# Altium schematic sheet HLK-AX3000-KIT-POWER_LED.SchDoc
size A3
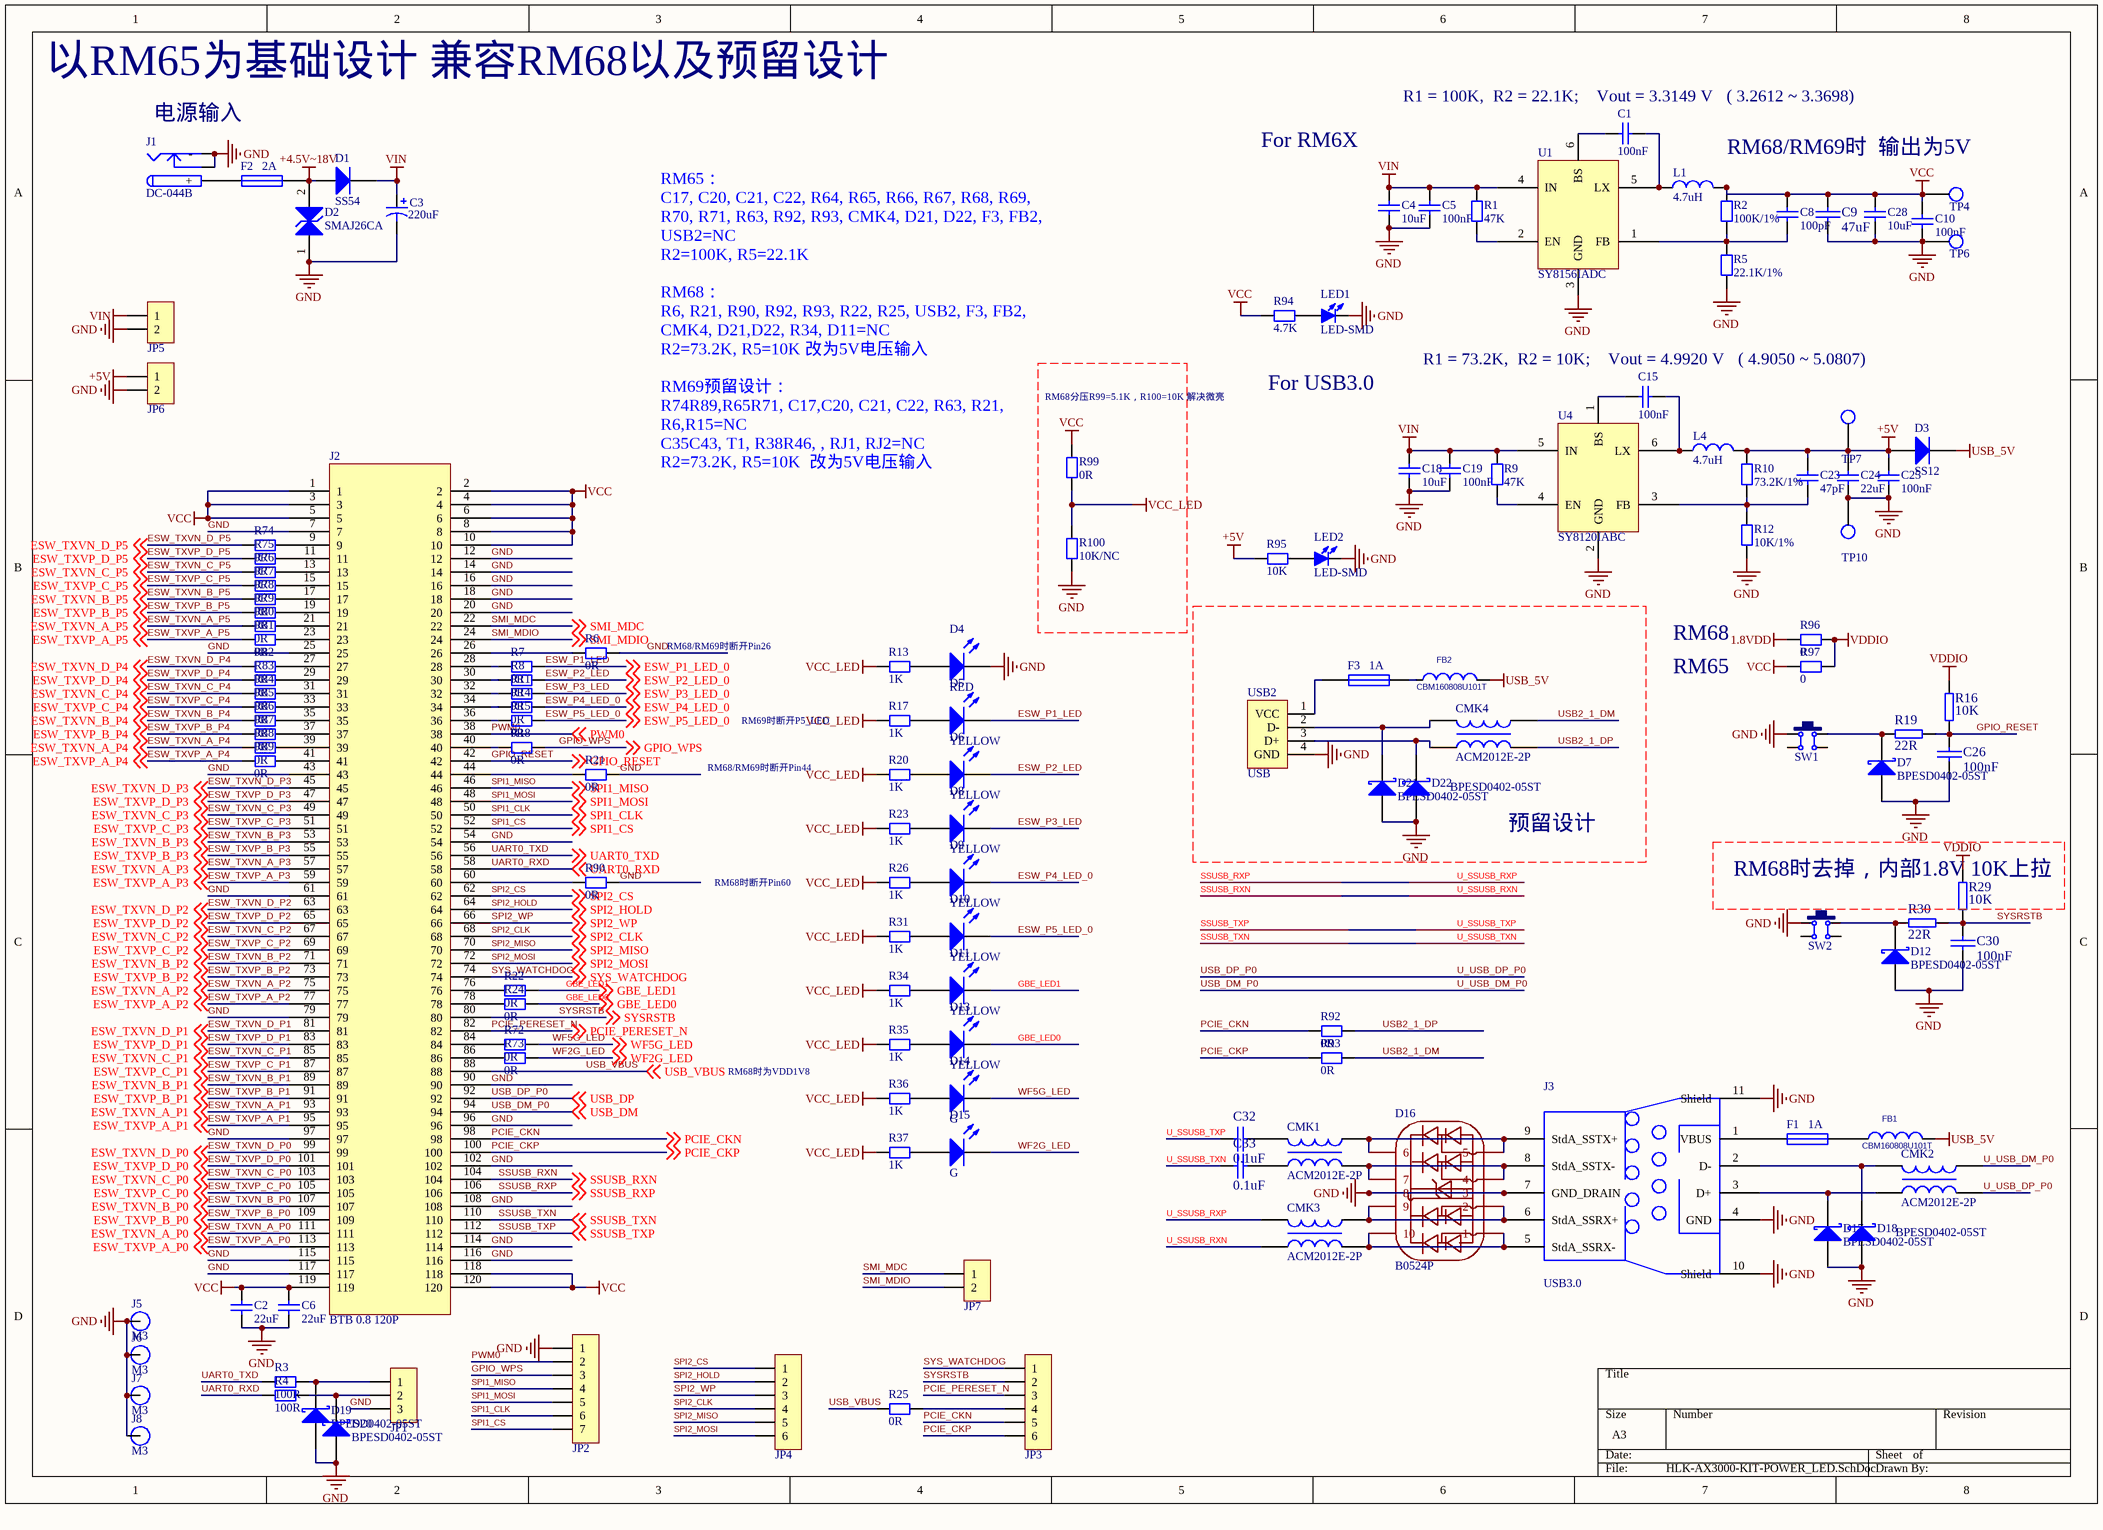
[diagram p0: HLK-AX3000-KIT-POWER_LED.SchDoc]

## Parts
C1  100nF  [C 0402_L]
C2  22uF  [C 0805_L]
C3  220uF  [CT 8*12 - C]
C4  10uF  [C 0805_L]
C5  100nF  [C 0402_L]
C6  22uF  [C 0805_L]
C8  100pF  [C 0402_L]
C9  47uF  [C 1206_L]
C10  100nF  [C 0402_L]
C15  100nF  [C 0402_L]
C18  10uF  [C 0805_L]
C19  100nF  [C 0402_L]
C23  47pF  [C 0402_L]
C24  22uF  [C 0805_L]
C25  100nF  [C 0402_L]
C26  100nF  [C 0402_L]
C28  10uF  [C 0603_L]
C30  100nF  [C 0402_L]
C32  0.1uF  [C 0402_L]
C33  0.1uF  [C 0402_L]
CMK1  ACM2012E-2P  [SMD_4P]
CMK2  ACM2012E-2P  [SMD_4P]
CMK3  ACM2012E-2P  [SMD_4P]
CMK4  ACM2012E-2P  [SMD_4P_2.1X2.1]
D1  SS54  [SMB]
D2  SMAJ26CA  [DO-214AC]
D3  SS12  [SMA]
D4  RED  [LED 3MM-R]
D5  YELLOW  [LED 3MM-Y]
D6  YELLOW  [LED 3MM-Y]
D7  BPESD0402-05ST  [esd0402]
D8  YELLOW  [LED 3MM-Y]
D9  YELLOW  [LED 3MM-Y]
D10  YELLOW  [LED 3MM-Y]
D11  YELLOW  [LED 3MM-Y]
D12  BPESD0402-05ST  [esd0402]
D13  YELLOW  [LED 3MM-Y]
D14  G  [LED 3MM-G]
D15  G  [LED 3MM-G]
D16  B0524P  [DFN-10]
D17  BPESD0402-05ST  [ESD0402]
D18  BPESD0402-05ST  [ESD0402]
D19  BPESD0402-05ST  [esd0402]
D20  BPESD0402-05ST  [esd0402]
D21  BPESD0402-05ST  [ESD0402]
D22  BPESD0402-05ST  [ESD0402]
F1  1A  [FU 0603]
F2  2A  [FU 1206]
F3  1A  [FU 0603]
FB1  CBM160808U101T  [L 0603]
FB2  CBM160808U101T  [L 0603]
J1  DC-044B  [DC-005]
J2  BTB 0.8 120P  [HLK-RM65]
J3  USB3.0  [USB3.0-9P-DIP]
J5  M3  [M3 125X200]
J6  M3  [M3 125X200]
J7  M3  [M3 125X200]
J8  M3  [M3 125X200]
JP1  HDR-1X3  [HDR2.54-LI-3P]  (value not drawn)
JP2  HDR-1X7  [HDR2.54-LI-7P]  (value not drawn)
JP3  HDR-1X6  [HDR2.54-LI-6P]  (value not drawn)
JP4  HDR-1X6  [HDR2.54-LI-6P]  (value not drawn)
JP5  HDR-1X2  [XH2.54-LI-2P]  (value not drawn)
JP6  HDR-1X2  [XH2.54-LI-2P]  (value not drawn)
JP7  HDR-1X2  [HDR2.54-LI-2P]  (value not drawn)
L1  4.7uH  [L 6*6]
L4  4.7uH  [L 4*4]
LED1  LED-SMD  [LED 0603G-L]
LED2  LED-SMD  [LED 0603G-L]
R1  47K  [R 0402_L]
R2  100K/1%  [R 0402_L]
R3  100R  [R 0402_L]
R4  100R  [R 0402_L]
R5  22.1K/1%  [R 0402_L]
R6  0R  [R 0402_L]
R7  0R  [R 0402_L]
R8  0R  [R 0402_L]
R9  47K  [R 0402_L]
R10  73.2K/1%  [R 0402_L]
R11  0R  [R 0402_L]
R12  10K/1%  [R 0402_L]
R13  1K  [R 0402_L]
R14  0R  [R 0402_L]
R15  0R  [R 0402_L]
R16  10K  [R 0402_l]
R17  1K  [R 0402_L]
R18  0R  [R 0402_L]
R19  22R  [R 0402_l]
R20  1K  [R 0402_L]
R21  0R  [R 0402_L]
R22  0R  [R 0402_L]
R23  1K  [R 0402_L]
R24  0R  [R 0402_L]
R25  0R  [R 0402_L]
R26  1K  [R 0402_L]
R29  10K  [R 0402_l]
R30  22R  [R 0402_l]
R31  1K  [R 0402_L]
R34  1K  [R 0402_L]
R35  1K  [R 0402_L]
R36  1K  [R 0402_L]
R37  1K  [R 0402_L]
R72  0R  [R 0402_L]
R73  0R  [R 0402_L]
R74  0R  [R 0402_L]
R75  0R  [R 0402_L]
R76  0R  [R 0402_L]
R77  0R  [R 0402_L]
R78  0R  [R 0402_L]
R79  0R  [R 0402_L]
R80  0R  [R 0402_L]
R81  0R  [R 0402_L]
R82  0R  [R 0402_L]
R83  0R  [R 0402_L]
R84  0R  [R 0402_L]
R85  0R  [R 0402_L]
R86  0R  [R 0402_L]
R87  0R  [R 0402_L]
R88  0R  [R 0402_L]
R89  0R  [R 0402_L]
R90  0R  [R 0402_L]
R92  0R  [R 0402_L]
R93  0R  [R 0402_L]
R94  4.7K  [R 0402_L]
R95  10K  [R 0402_L]
R96  0  [R 0402_L]
R97  0  [R 0402_L]
R99  0R  [R 0402_L]
R100  10K/NC  [R 0402_L]
SW1  6x6x5  [TSW DIP-4.5*4.5*3_V]  (value not drawn)
SW2  6x6x5  [TSW DIP-4.5*4.5*3_V]  (value not drawn)
TP4  测试点  [TEST 1.6]  (value not drawn)
TP6  测试点  [TEST 1.6]  (value not drawn)
TP7  测试点  [TEST 1.6]  (value not drawn)
TP10  测试点  [TEST 1.6]  (value not drawn)
U1  SY8156IADC  [SOT23-6N]
U4  SY8120IABC  [SOT23-6N]
USB2  USB  [USB-A/S_E]

## Nets
1.8VDD: R96.2
+4.5V~18V: D1.1(A) D2.2 F2.2
+5V: C23.2 C24.2 C25.1 D3.1(A) JP6.1 L4.2 R10.1 R95.2 TP7.1
GND: C2.1 C3.2 C4.1 C5.2 C6.1 C9.1 C10.2 C18.1 C19.2 C24.1 C25.2 C26.1 C28.2 C30.1 D2.1 D4.2(K) D7.1(A) D12.1(A) D16.3 D16.8 D17.1(A) D18.1(A) D19.1(A) D20.1(A) D21.1(A) D22.1(A) J1.2(-) J1.3 J2.7 J2.12 J2.14 J2.16 J2.18 J2.20 J2.25 J2.43 J2.54 J2.61 J2.79 J2.90 J2.96 J2.97 J2.102 J2.108 J2.114 J2.115 J2.116 J2.117 J3.4(GND) J3.7(GND_DRAIN) J3.10(Shield) J3.11(Shield) J5.1(GND) J6.1(GND) J7.1(GND) J8.1(GND) JP1.3 JP2.1 JP5.2 JP6.2 LED1.2(K) LED2.2(K) R5.2 R6.1 R12.2 R21.1 R90.1 R100.2 SW1.1 SW2.1 TP6.1 TP10.1 U1.3(GND) U4.2(GND) USB2.4(GND)
USB_5V: D3.2(K) FB1.1 FB2.1
VCC: C2.2 C6.2 C8.2 C9.2 C10.1 C28.1 J2.1 J2.2 J2.3 J2.4 J2.5 J2.6 J2.8 J2.10 J2.118 J2.119 J2.120 L1.2 R2.1 R94.2 R97.2 R99.1 TP4.1
VCC_LED: R13.2 R17.2 R20.2 R23.2 R26.2 R31.2 R34.2 R35.2 R36.2 R37.2 R99.2 R100.1
VDDIO: R16.1 R29.1 R96.1 R97.1
VIN: C3.1 C4.2 C5.1 C18.2 C19.1 D1.2(K) JP5.1 R1.1 R9.1 U1.4(IN) U4.5(IN)
ESW_P1_LED: D5.2(K) R7.1 ; off-sheet ESW_P1_LED_0  [also labelled ESW_P1_LED_0]
ESW_P2_LED: D6.2(K) R8.1 ; off-sheet ESW_P2_LED_0  [also labelled ESW_P2_LED_0]
ESW_P3_LED: D8.2(K) R11.1 ; off-sheet ESW_P3_LED_0  [also labelled ESW_P3_LED_0]
ESW_P4_LED_0: D9.2(K) R14.1 ; off-sheet ESW_P4_LED_0
ESW_P5_LED_0: D10.2(K) R15.1 ; off-sheet ESW_P5_LED_0
ESW_TXVN_A_P0: J2.111 ; off-sheet ESW_TXVN_A_P0
ESW_TXVN_A_P1: J2.93 ; off-sheet ESW_TXVN_A_P1
ESW_TXVN_A_P2: J2.75 ; off-sheet ESW_TXVN_A_P2
ESW_TXVN_A_P3: J2.57 ; off-sheet ESW_TXVN_A_P3
ESW_TXVN_A_P4: R88.2 ; off-sheet ESW_TXVN_A_P4
ESW_TXVN_A_P5: R80.2 ; off-sheet ESW_TXVN_A_P5
ESW_TXVN_B_P0: J2.107 ; off-sheet ESW_TXVN_B_P0
ESW_TXVN_B_P1: J2.89 ; off-sheet ESW_TXVN_B_P1
ESW_TXVN_B_P2: J2.71 ; off-sheet ESW_TXVN_B_P2
ESW_TXVN_B_P3: J2.53 ; off-sheet ESW_TXVN_B_P3
ESW_TXVN_B_P4: R86.2 ; off-sheet ESW_TXVN_B_P4
ESW_TXVN_B_P5: R78.2 ; off-sheet ESW_TXVN_B_P5
ESW_TXVN_C_P0: J2.103 ; off-sheet ESW_TXVN_C_P0
ESW_TXVN_C_P1: J2.85 ; off-sheet ESW_TXVN_C_P1
ESW_TXVN_C_P2: J2.67 ; off-sheet ESW_TXVN_C_P2
ESW_TXVN_C_P3: J2.49 ; off-sheet ESW_TXVN_C_P3
ESW_TXVN_C_P4: R84.2 ; off-sheet ESW_TXVN_C_P4
ESW_TXVN_C_P5: R76.2 ; off-sheet ESW_TXVN_C_P5
ESW_TXVN_D_P0: J2.99 ; off-sheet ESW_TXVN_D_P0
ESW_TXVN_D_P1: J2.81 ; off-sheet ESW_TXVN_D_P1
ESW_TXVN_D_P2: J2.63 ; off-sheet ESW_TXVN_D_P2
ESW_TXVN_D_P3: J2.45 ; off-sheet ESW_TXVN_D_P3
ESW_TXVN_D_P4: R82.2 ; off-sheet ESW_TXVN_D_P4
ESW_TXVN_D_P5: R74.2 ; off-sheet ESW_TXVN_D_P5
ESW_TXVP_A_P0: J2.113 ; off-sheet ESW_TXVP_A_P0
ESW_TXVP_A_P1: J2.95 ; off-sheet ESW_TXVP_A_P1
ESW_TXVP_A_P2: J2.77 ; off-sheet ESW_TXVP_A_P2
ESW_TXVP_A_P3: J2.59 ; off-sheet ESW_TXVP_A_P3
ESW_TXVP_A_P4: R89.2 ; off-sheet ESW_TXVP_A_P4
ESW_TXVP_A_P5: R81.2 ; off-sheet ESW_TXVP_A_P5
ESW_TXVP_B_P0: J2.109 ; off-sheet ESW_TXVP_B_P0
ESW_TXVP_B_P1: J2.91 ; off-sheet ESW_TXVP_B_P1
ESW_TXVP_B_P2: J2.73 ; off-sheet ESW_TXVP_B_P2
ESW_TXVP_B_P3: J2.55 ; off-sheet ESW_TXVP_B_P3
ESW_TXVP_B_P4: R87.2 ; off-sheet ESW_TXVP_B_P4
ESW_TXVP_B_P5: R79.2 ; off-sheet ESW_TXVP_B_P5
ESW_TXVP_C_P0: J2.105 ; off-sheet ESW_TXVP_C_P0
ESW_TXVP_C_P1: J2.87 ; off-sheet ESW_TXVP_C_P1
ESW_TXVP_C_P2: J2.69 ; off-sheet ESW_TXVP_C_P2
ESW_TXVP_C_P3: J2.51 ; off-sheet ESW_TXVP_C_P3
ESW_TXVP_C_P4: R85.2 ; off-sheet ESW_TXVP_C_P4
ESW_TXVP_C_P5: R77.2 ; off-sheet ESW_TXVP_C_P5
ESW_TXVP_D_P0: J2.101 ; off-sheet ESW_TXVP_D_P0
ESW_TXVP_D_P1: J2.83 ; off-sheet ESW_TXVP_D_P1
ESW_TXVP_D_P2: J2.65 ; off-sheet ESW_TXVP_D_P2
ESW_TXVP_D_P3: J2.47 ; off-sheet ESW_TXVP_D_P3
ESW_TXVP_D_P4: R83.2 ; off-sheet ESW_TXVP_D_P4
ESW_TXVP_D_P5: R75.2 ; off-sheet ESW_TXVP_D_P5
GBE_LED0: D13.2(K) R24.1 ; off-sheet GBE_LED0
GBE_LED1: D11.2(K) R22.1 ; off-sheet GBE_LED1
GPIO_RESET: C26.2 J2.42 R16.2 R19.2 ; off-sheet GPIO_RESET
GPIO_WPS: JP2.3 R18.1 ; off-sheet GPIO_WPS
PCIE_CKN: J2.98 JP3.5 R92.2 ; off-sheet PCIE_CKN
PCIE_CKP: J2.100 JP3.6 R93.2 ; off-sheet PCIE_CKP
PCIE_PERESET_N: J2.82 JP3.3 ; off-sheet PCIE_PERESET_N
PWM0: J2.38 JP2.2 ; off-sheet PWM0
SMI_MDC: J2.22 JP7.1 ; off-sheet SMI_MDC
SMI_MDIO: J2.24 JP7.2 ; off-sheet SMI_MDIO
SPI1_CLK: J2.50 JP2.6 ; off-sheet SPI1_CLK
SPI1_CS: J2.52 JP2.7 ; off-sheet SPI1_CS
SPI1_MISO: J2.46 JP2.4 ; off-sheet SPI1_MISO
SPI1_MOSI: J2.48 JP2.5 ; off-sheet SPI1_MOSI
SPI2_CLK: J2.68 JP4.4 ; off-sheet SPI2_CLK
SPI2_CS: J2.62 JP4.1 ; off-sheet SPI2_CS
SPI2_HOLD: J2.64 JP4.2 ; off-sheet SPI2_HOLD
SPI2_MISO: J2.70 JP4.5 ; off-sheet SPI2_MISO
SPI2_MOSI: J2.72 JP4.6 ; off-sheet SPI2_MOSI
SPI2_WP: J2.66 JP4.3 ; off-sheet SPI2_WP
SSUSB_RXN: CMK3.1 J2.104 ; off-sheet SSUSB_RXN  [also labelled U_SSUSB_RXN]
SSUSB_RXP: CMK3.2 J2.106 ; off-sheet SSUSB_RXP  [also labelled U_SSUSB_RXP]
SSUSB_TXN: C33.2 J2.110 ; off-sheet SSUSB_TXN  [also labelled U_SSUSB_TXN]
SSUSB_TXP: C32.2 J2.112 ; off-sheet SSUSB_TXP  [also labelled U_SSUSB_TXP]
SYS_WATCHDOG: J2.74 JP3.1 ; off-sheet SYS_WATCHDOG
SYSRSTB: C30.2 J2.80 JP3.2 R29.2 R30.2 ; off-sheet SYSRSTB
U_USB_DM_P0: CMK2.3 J2.94 ; off-sheet USB_DM  [also labelled USB_DM, USB_DM_P0]
U_USB_DP_P0: CMK2.4 J2.92 ; off-sheet USB_DP  [also labelled USB_DP, USB_DP_P0]
UART0_RXD: J2.58 R4.2 ; off-sheet UART0_RXD
UART0_TXD: J2.56 R3.2 ; off-sheet UART0_TXD
USB2_1_DM: CMK4.3 R93.1
USB2_1_DP: CMK4.4 R92.1
USB_VBUS: J2.88 R25.2 ; off-sheet USB_VBUS
WF2G_LED: D15.2(K) R73.1 ; off-sheet WF2G_LED
WF5G_LED: D14.2(K) R72.1 ; off-sheet WF5G_LED
NetC1_1: C1.1 U1.6(BS)
NetC1_2: C1.2 L1.1 U1.5(LX)
NetC8_1: C8.1 R2.2 R5.1 U1.1(FB)
NetC15_1: C15.1 U4.1(BS)
NetC15_2: C15.2 L4.1 U4.6(LX)
NetC23_1: C23.1 R10.2 R12.1 U4.3(FB)
NetC32_1: C32.1 CMK1.2
NetC33_1: C33.1 CMK1.1
NetCMK1_3: CMK1.3 D16.5 D16.6 J3.9(StdA_SSTX+)
NetCMK1_4: CMK1.4 D16.4 D16.7 J3.8(StdA_SSTX-)
NetCMK2_1: CMK2.1 D17.2(K) J3.3(D+)
NetCMK2_2: CMK2.2 D18.2(K) J3.2(D-)
NetCMK3_3: CMK3.3 D16.2 D16.9 J3.6(StdA_SSRX+)
NetCMK3_4: CMK3.4 D16.1 D16.10 J3.5(StdA_SSRX-)
NetCMK4_1: CMK4.1 D22.2(K) USB2.3(D+)
NetCMK4_2: CMK4.2 D21.2(K) USB2.2(D-)
NetD4_1: D4.1(A) R13.1
NetD5_1: D5.1(A) R17.1
NetD6_1: D6.1(A) R20.1
NetD7_2: D7.2(K) R19.1 SW1.2
NetD8_1: D8.1(A) R23.1
NetD9_1: D9.1(A) R26.1
NetD10_1: D10.1(A) R31.1
NetD11_1: D11.1(A) R34.1
NetD12_2: D12.2(K) R30.1 SW2.2
NetD13_1: D13.1(A) R35.1
NetD14_1: D14.1(A) R36.1
NetD15_1: D15.1(A) R37.1
NetD19_2: D19.2(K) JP1.1 R3.1
NetD20_2: D20.2(K) JP1.2 R4.1
NetF1_1: F1.1 J3.1(VBUS)
NetF1_2: F1.2 FB1.2
NetF2_1: F2.1 J1.1(+)
NetF3_1: F3.1 USB2.1(VCC)
NetF3_2: F3.2 FB2.2
NetJ2_9: J2.9 R74.1
NetJ2_11: J2.11 R75.1
NetJ2_13: J2.13 R76.1
NetJ2_15: J2.15 R77.1
NetJ2_17: J2.17 R78.1
NetJ2_19: J2.19 R79.1
NetJ2_21: J2.21 R80.1
NetJ2_23: J2.23 R81.1
NetJ2_26: J2.26 R6.2
NetJ2_27: J2.27 R82.1
NetJ2_28: J2.28 R7.2
NetJ2_29: J2.29 R83.1
NetJ2_30: J2.30 R8.2
NetJ2_31: J2.31 R84.1
NetJ2_32: J2.32 R11.2
NetJ2_33: J2.33 R85.1
NetJ2_34: J2.34 R14.2
NetJ2_35: J2.35 R86.1
NetJ2_36: J2.36 R15.2
NetJ2_37: J2.37 R87.1
NetJ2_39: J2.39 R88.1
NetJ2_40: J2.40 R18.2
NetJ2_41: J2.41 R89.1
NetJ2_44: J2.44 R21.2
NetJ2_60: J2.60 R90.2
NetJ2_76: J2.76 R22.2
NetJ2_78: J2.78 R24.2
NetJ2_84: J2.84 R72.2
NetJ2_86: J2.86 R73.2
NetJP3_4: JP3.4 R25.1
NetLED1_1: LED1.1(A) R94.1
NetLED2_1: LED2.1(A) R95.1
NetR1_2: R1.2 U1.2(EN)
NetR9_2: R9.2 U4.4(EN)

Not connected (* = marked no-connect by the designer): SW1 3 4; SW2 3 4

## Notes on the sheet
- 以RM65为基础设计 兼容RM68以及预留设计
- (near C1) R1 = 100K,  R2 = 22.1K;    Vout = 3.3149 V   ( 3.2612 ~ 3.3698)
- (near J1) 电源输入
- For RM6X
- RM68/RM69时  输出为5V
- (near C15) R1 = 73.2K,  R2 = 10K;    Vout = 4.9920 V   ( 4.9050 ~ 5.0807)
- RM68分压R99=5.1K，R100=10K 解决微亮
- For USB3.0
- RM65：
  C17, C20, C21, C22, R64, R65, R66, R67, R68, R69, R70, R71, R63, R92, R93, CMK4, D21, D22, F3, FB2, USB2=NC
  R2=100K, R5=22.1K
  RM68：
  R6, R21, R90, R92, R93, R22, R25, USB2, F3, FB2, CMK4, D21,D22, R34, D11=NC
  R2=73.2K, R5=10K 改为5V电压输入
  RM69预留设计：
  R74R89,R65R71, C17,C20, C21, C22, R63, R21, R6,R15=NC
  C35C43, T1, R38R46, , RJ1, RJ2=NC
  R2=73.2K, R5=10K  改为5V电压输入
- RM68/RM69时断开Pin26
- RM68
- RM69时断开P5_LED
- RM65
- RM68/RM69时断开Pin44
- 预留设计
- RM68时断开Pin60
- (near R29) RM68时去掉，内部1.8V 10K上拉
- RM68时为VDD1V8

## Library data of the parts
C1 C5 C10 C15 C19 C25 C28 = Cap: Capacitor; 物料名称: 贴片电容; 物料编码: 3.01.04.0056
C2 C4 C6 C18 C23 C24 = Cap: Capacitor; Manufacturer: Generic Components; Class: Passive; Value: 100pF; Published: 08/06/2000; Publisher: Altium Hobart Technology Centre; SubClass: Capacitor
C3 = Cap Pol1: Polarized Capacitor (Radial); Published: 8-Jun-2000; LatestRevisionDate: 17-Jul-2002; LatestRevisionNote: Re-released for DXP Platform.; PackageReference: RB7.6-15; Publisher: Altium Limited; Value: 220uF
C8 = Cap: Capacitor; Manufacturer: Generic Components; Class: Passive; Published: 08/06/2000; Publisher: Altium Hobart Technology Centre; SubClass: Capacitor; Value: 100pF
C9 C26 C30 C32 C33 = CAP: Capacitor
CMK1-CMK4 = CMK1
D1 D3 = Diode: Default Diode; Published: 8-Jun-2000; LatestRevisionDate: 17-Jul-2002; LatestRevisionNote: Re-released for DXP Platform.; PackageDocument: Sep-1996; PackageReference: SMC; Publisher: Altium Limited; Code_JEDEC: DO-214-AB
D2 = TVS
D4-D6 D8-D11 D13-D15 = LED0: 贴片发光二极管; Published: 8-Jun-2000; LatestRevisionDate: 08-Jul-2005; LatestRevisionNote: Mech Layer 1 removed.; PackageReference: LED-0; Publisher: Altium Limited; PackageDescription: LED; 2 Leads
D7 D12 D17-D22 = Diode BAS70: Silicon AF Schottky Diode for High-Speed Switching; Note: Pin 2 is not connected and not drawn.; Published: 21-Mar-2003; DatasheetDocument: Oct-1999; PackageDocument: Sep-2001; PackageReference: SOT-23; Publisher: Altium Limited; ComponentLink1Description: Manufacturer Link; ComponentLink1URL: http://www.infineon.com/; ComponentLink2Description: Datasheet; ComponentLink2URL: http://www.infineon.com/upload/Document/cmc_upload/documents/009/382/bas40_bas140series_1.pdf
F1-F3 = Fuse 1: Fuse; Published: 8-Jun-2000; LatestRevisionDate: 17-Jul-2002; LatestRevisionNote: Re-released for DXP Platform.; PackageReference: PIN-W2/E2.8; Publisher: Altium Limited
FB1 FB2 = INDUCTOR: MFR_Name: MURATA; MFR_PN: BLM15PX121SZ1D
J1 = DC-044B: Low Voltage Power Supply Connector; Published: 17-Dec-2003; DatasheetDocument: 09-May-2002; Publisher: Altium Limited; ComponentLink1Description: Manufacturer Link; ComponentLink1URL: http://domino.kycon.com/internet/Products.html
J5-J8 = M3: 铜柱孔; 版权归属: 源创客; BOM名称: 铜柱孔; 学习资源: www.ooocke.com
JP1 = Header 3: 3P接插件; 版权归属: 源创客; BOM名称: 3P接插件; 学习资源: www.ooocke.com
JP2 = Header 7: 7P接插件; 版权归属: 源创客; BOM名称: 7P接插件; 学习资源: www.ooocke.com
JP3 JP4 = Header 6: 6P接插件; 版权归属: 源创客; BOM名称: 6P接插件; 学习资源: www.ooocke.com
JP5-JP7 = Header 2: 2P接插件; 版权归属: 源创客; BOM名称: 2P接插件; 学习资源: www.ooocke.com
L1 L4 = LineInductors: FootPrint: 0805
LED1 LED2 = LED-SMD: 贴片LED; 版权归属: 源创客; BOM名称: 贴片LED; 学习资源: www.ooocke.com
R1-R15 R17 R18 R20-R26 R31 R34-R37 R72-R90 R92-R97 R99 R100 = R: 贴片电阻; 版权归属: 源创客; BOM名称: 贴片电阻; 学习资源: www.ooocke.com
R16 R19 R29 R30 = RES2
SW1 SW2 = TSW DIP-6x6: 直插6x6轻触开关; 版权归属: 源创客; BOM名称: 直插6x6轻触开关; 学习资源: www.ooocke.com
TP4 TP6 TP7 TP10 = TP
U1 = SY8105
U4 = SY8201
USB2 = USB-A/S: USB-A型母接口; 版权归属: 源创客; BOM名称: USB-A型母接口; 学习资源: www.ooocke.com